# Altium project Flash_DDR.PrjPCB
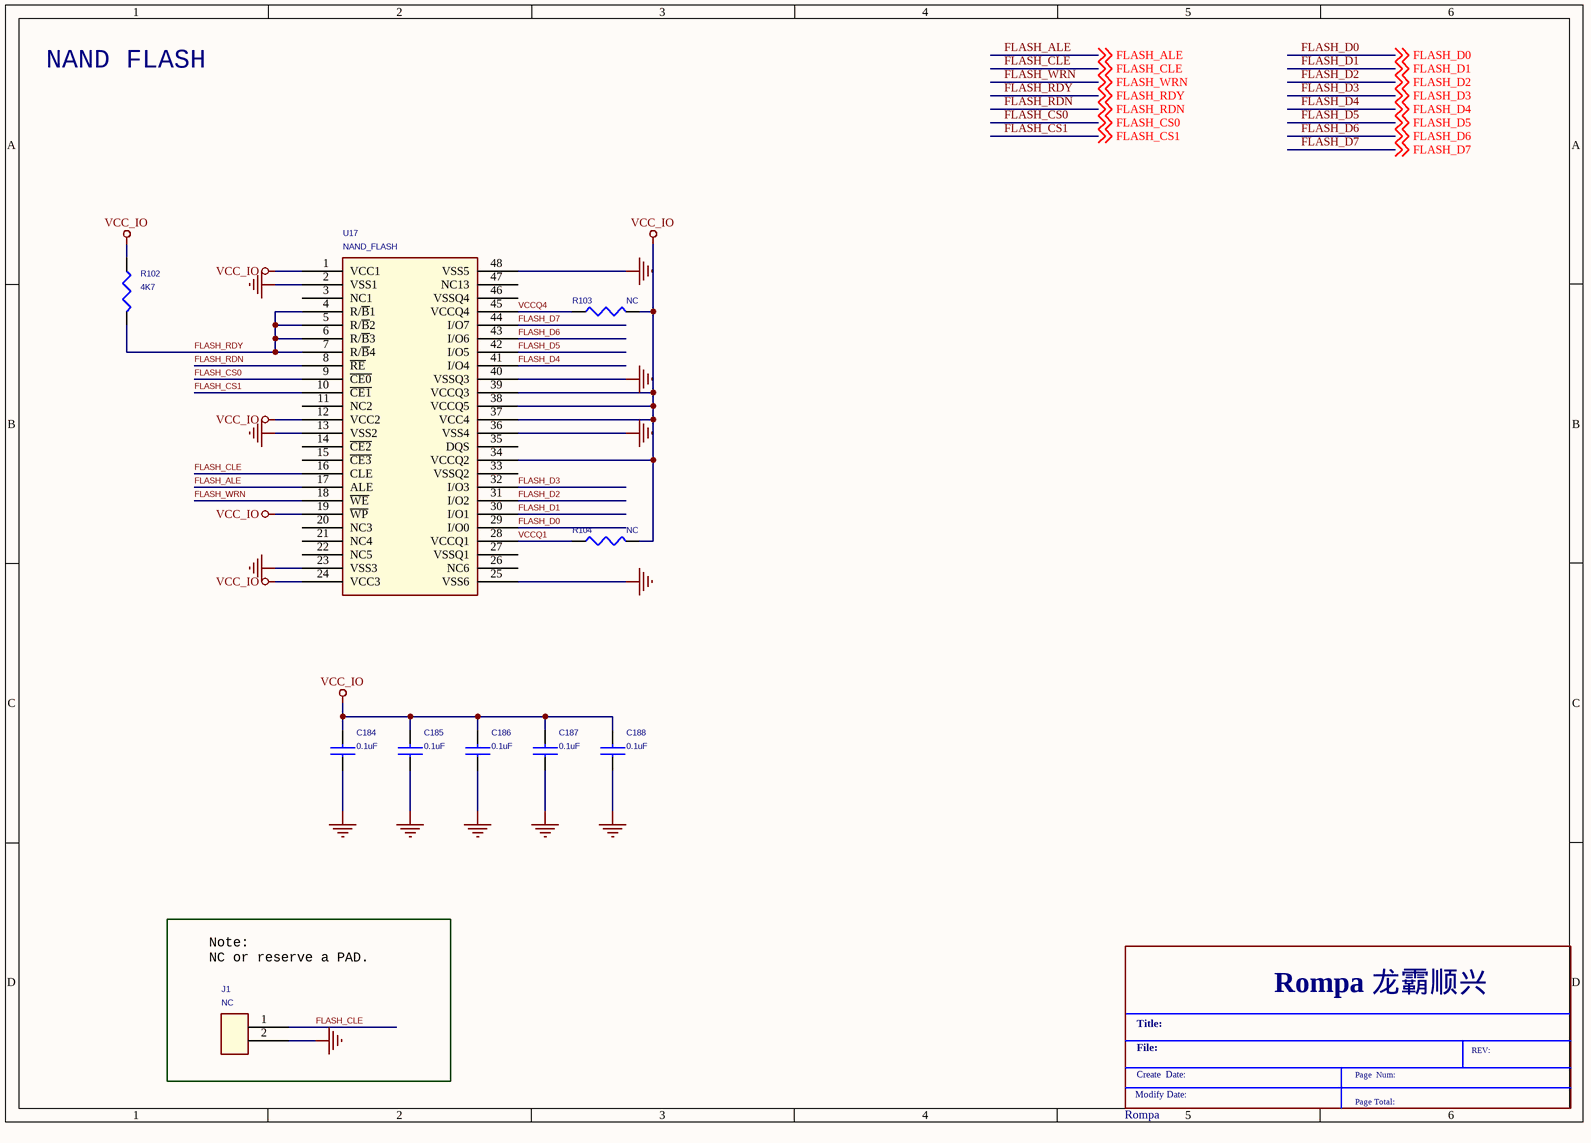
[diagram p0: Option_Nand_Flash.SchDoc]
2 sheets, 50 parts. Net scope: global (net labels, ports and power ports of the same name join across sheets).
Sheets:
  Option_Nand_Flash.SchDoc
  Option_DDR3_96ball.SchDoc

## Sheet Option_Nand_Flash.SchDoc
size 297 x 209 mm

### Parts
*  Rompa  (graphical)
C184  0.1uF  [C0402]
C185  0.1uF  [C0402]
C186  0.1uF  [C0402]
C187  0.1uF  [C0402]
C188  0.1uF  [C0402]
J1  NC  [R0603]
R102  4K7  [R0402]
R103  NC  [R0402]
R104  NC  [R0402]
U17  NAND_FLASH  [TSOP1-48]

### Nets
GND: C184.1 C185.1 C186.1 C187.1 C188.1 J1.2 U17.2(VSS1) U17.13(VSS2) U17.23(VSS3) U17.25(VSS6) U17.36(VSS4) U17.40(VSSQ3) U17.48(VSS5)
VCC_IO: C184.2 C185.2 C186.2 C187.2 C188.2 R102.1 R103.2 R104.2 U17.1(VCC1) U17.12(VCC2) U17.19(~{WP}) U17.24(VCC3) U17.34(VCCQ2) U17.37(VCC4) U17.38(VCCQ5) U17.39(VCCQ3)
FLASH_ALE: U17.17(ALE) ; off-sheet FLASH_ALE
FLASH_CLE: J1.1 U17.16(CLE) ; off-sheet FLASH_CLE
FLASH_CS0: U17.9(~{CE0}) ; off-sheet FLASH_CS0
FLASH_CS1: U17.10(~{CE1}) ; off-sheet FLASH_CS1
FLASH_D0: U17.29(I/O0) ; off-sheet FLASH_D0
FLASH_D1: U17.30(I/O1) ; off-sheet FLASH_D1
FLASH_D2: U17.31(I/O2) ; off-sheet FLASH_D2
FLASH_D3: U17.32(I/O3) ; off-sheet FLASH_D3
FLASH_D4: U17.41(I/O4) ; off-sheet FLASH_D4
FLASH_D5: U17.42(I/O5) ; off-sheet FLASH_D5
FLASH_D6: U17.43(I/O6) ; off-sheet FLASH_D6
FLASH_D7: U17.44(I/O7) ; off-sheet FLASH_D7
FLASH_RDN: U17.8(~{RE}) ; off-sheet FLASH_RDN
FLASH_RDY: R102.2 U17.4(R/~{B}1) U17.5(R/~{B}2) U17.6(R/~{B}3) U17.7(R/~{B}4) ; off-sheet FLASH_RDY
FLASH_WRN: U17.18(~{WE}) ; off-sheet FLASH_WRN
VCCQ1: R104.1 U17.28(VCCQ1)
VCCQ4: R103.1 U17.45(VCCQ4)

Not connected (* = marked no-connect by the designer): U17 3(NC1) 11(NC2) 14(~{CE2}) 15(~{CE3}) 20(NC3) 21(NC4) 22(NC5) 26(NC6) 27(VSSQ1) 33(VSSQ2) 35(DQS) 46(VSSQ4) 47(NC13)

### Notes on the sheet
- NAND FLASH
- (near J1) Note:
  NC or reserve a PAD.
- (in symbol Rompa) Rompa 龙霸顺兴; Title:; File:; REV:; Create  Date:; Page  Num:; Modify Date:; Page Total:

### Library data of the parts
C184-C188 = CAP NP: RoHS CHIP CAP 0.1uF +10/-10% X7R
J1 = CON2: TEST
R102-R104 = RES 1B: ROHS CHIP RES 4.7K 1/16W 5%
U17 = NANDFLASH_0: NAND Flash,2.7V,3.3V,3.6V,2G*8,N/A,-40℃~85℃,TSOP-48P

## Sheet Option_DDR3_96ball.SchDoc
size 297 x 209 mm
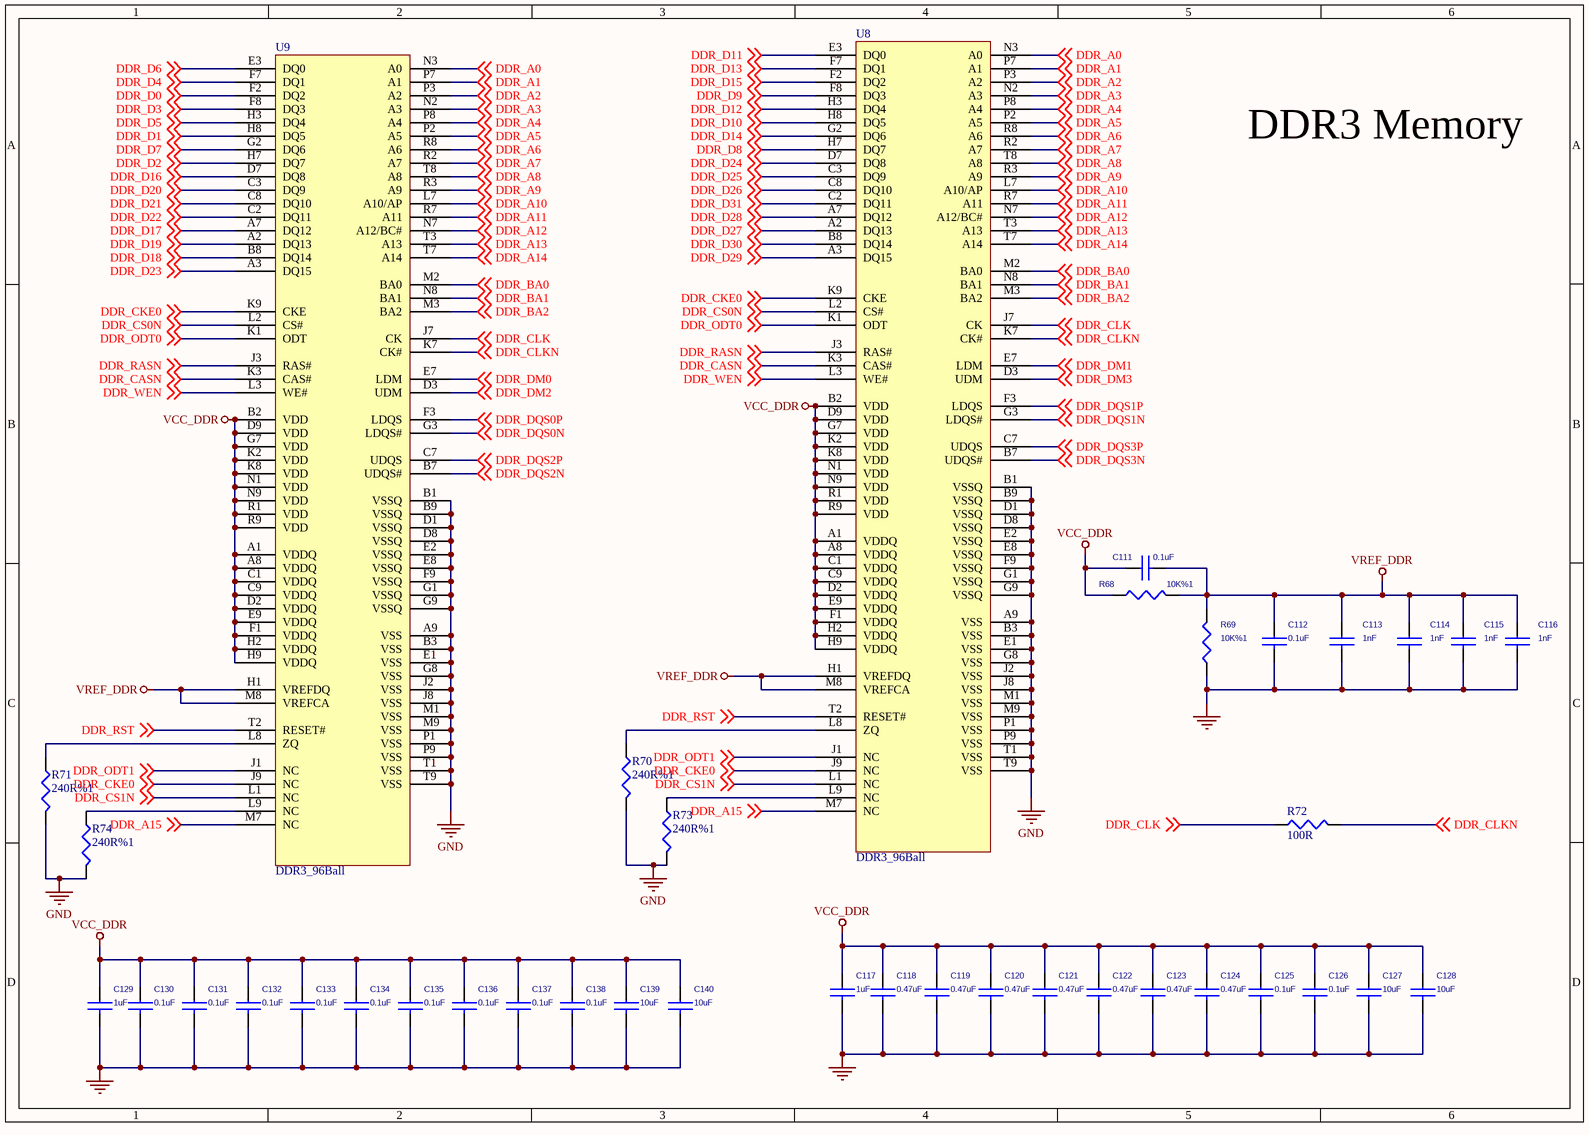
[diagram p1: Option_DDR3_96ball.SchDoc]

### Parts
C111  0.1uF  [C0402]
C112  0.1uF  [C0402]
C113  1nF  [C0402]
C114  1nF  [C0402]
C115  1nF  [C0402]
C116  1nF  [C0402]
C117  1uF  [C0402]
C118  0.47uF  [C0402]
C119  0.47uF  [C0402]
C120  0.47uF  [C0402]
C121  0.47uF  [C0402]
C122  0.47uF  [C0402]
C123  0.47uF  [C0402]
C124  0.47uF  [C0402]
C125  0.1uF  [C0402]
C126  0.1uF  [C0402]
C127  10uF  [C0805]
C128  10uF  [C0805]
C129  1uF  [C0402]
C130  0.1uF  [C0402]
C131  0.1uF  [C0402]
C132  0.1uF  [C0402]
C133  0.1uF  [C0402]
C134  0.1uF  [C0402]
C135  0.1uF  [C0402]
C136  0.1uF  [C0402]
C137  0.1uF  [C0402]
C138  0.1uF  [C0402]
C139  10uF  [C0805]
C140  10uF  [C0805]
R68  10K%1  [R0402]
R69  10K%1  [R0402]
R70  240R%1  [R0402]
R71  240R%1  [R0402]
R72  100R  [R0402]
R73  240R%1  [R0402]
R74  240R%1  [R0402]
U8  DDR3_96Ball
U9  DDR3_96Ball

### Nets
GND: C112.2 C113.2 C114.2 C115.2 C116.2 C117.2 C118.2 C119.2 C120.2 C121.2 C122.2 C123.2 C124.2 C125.2 C126.2 C127.2 C128.2 C129.2 C130.2 C131.2 C132.2 C133.2 C134.2 C135.2 C136.2 C137.2 C138.2 C139.2 C140.2 R69.1 R70.2 R71.2 R73.2 R74.2 U8.A9(VSS) U8.B1(VSSQ) U8.B3(VSS) U8.B9(VSSQ) U8.D1(VSSQ) U8.D8(VSSQ) U8.E1(VSS) U8.E2(VSSQ) U8.E8(VSSQ) U8.F9(VSSQ) U8.G1(VSSQ) U8.G8(VSS) U8.G9(VSSQ) U8.J2(VSS) U8.J8(VSS) U8.M1(VSS) U8.M9(VSS) U8.P1(VSS) U8.P9(VSS) U8.T1(VSS) U8.T9(VSS) U9.A9(VSS) U9.B1(VSSQ) U9.B3(VSS) U9.B9(VSSQ) U9.D1(VSSQ) U9.D8(VSSQ) U9.E1(VSS) U9.E2(VSSQ) U9.E8(VSSQ) U9.F9(VSSQ) U9.G1(VSSQ) U9.G8(VSS) U9.G9(VSSQ) U9.J2(VSS) U9.J8(VSS) U9.M1(VSS) U9.M9(VSS) U9.P1(VSS) U9.P9(VSS) U9.T1(VSS) U9.T9(VSS)
VCC_DDR: C111.1 C117.1 C118.1 C119.1 C120.1 C121.1 C122.1 C123.1 C124.1 C125.1 C126.1 C127.1 C128.1 C129.1 C130.1 C131.1 C132.1 C133.1 C134.1 C135.1 C136.1 C137.1 C138.1 C139.1 C140.1 R68.1 U8.A1(VDDQ) U8.A8(VDDQ) U8.B2(VDD) U8.C1(VDDQ) U8.C9(VDDQ) U8.D2(VDDQ) U8.D9(VDD) U8.E9(VDDQ) U8.F1(VDDQ) U8.G7(VDD) U8.H2(VDDQ) U8.H9(VDDQ) U8.K2(VDD) U8.K8(VDD) U8.N1(VDD) U8.N9(VDD) U8.R1(VDD) U8.R9(VDD) U9.A1(VDDQ) U9.A8(VDDQ) U9.B2(VDD) U9.C1(VDDQ) U9.C9(VDDQ) U9.D2(VDDQ) U9.D9(VDD) U9.E9(VDDQ) U9.F1(VDDQ) U9.G7(VDD) U9.H2(VDDQ) U9.H9(VDDQ) U9.K2(VDD) U9.K8(VDD) U9.N1(VDD) U9.N9(VDD) U9.R1(VDD) U9.R9(VDD)
VREF_DDR: C111.2 C112.1 C113.1 C114.1 C115.1 C116.1 R68.2 R69.2 U8.H1(VREFDQ) U8.M8(VREFCA) U9.H1(VREFDQ) U9.M8(VREFCA)
DDR_A0: U8.N3(A0) U9.N3(A0) ; off-sheet DDR_A0
DDR_A1: U8.P7(A1) U9.P7(A1) ; off-sheet DDR_A1
DDR_A2: U8.P3(A2) U9.P3(A2) ; off-sheet DDR_A2
DDR_A3: U8.N2(A3) U9.N2(A3) ; off-sheet DDR_A3
DDR_A4: U8.P8(A4) U9.P8(A4) ; off-sheet DDR_A4
DDR_A5: U8.P2(A5) U9.P2(A5) ; off-sheet DDR_A5
DDR_A6: U8.R8(A6) U9.R8(A6) ; off-sheet DDR_A6
DDR_A7: U8.R2(A7) U9.R2(A7) ; off-sheet DDR_A7
DDR_A8: U8.T8(A8) U9.T8(A8) ; off-sheet DDR_A8
DDR_A9: U8.R3(A9) U9.R3(A9) ; off-sheet DDR_A9
DDR_A10: U8.L7(A10/AP) U9.L7(A10/AP) ; off-sheet DDR_A10
DDR_A11: U8.R7(A11) U9.R7(A11) ; off-sheet DDR_A11
DDR_A12: U8.N7(A12/BC#) U9.N7(A12/BC#) ; off-sheet DDR_A12
DDR_A13: U8.T3(A13) U9.T3(A13) ; off-sheet DDR_A13
DDR_A14: U8.T7(A14) U9.T7(A14) ; off-sheet DDR_A14
DDR_A15: U8.M7(NC) U9.M7(NC) ; off-sheet DDR_A15
DDR_BA0: U8.M2(BA0) U9.M2(BA0) ; off-sheet DDR_BA0
DDR_BA1: U8.N8(BA1) U9.N8(BA1) ; off-sheet DDR_BA1
DDR_BA2: U8.M3(BA2) U9.M3(BA2) ; off-sheet DDR_BA2
DDR_CASN: U8.K3(CAS#) U9.K3(CAS#) ; off-sheet DDR_CASN
DDR_CKE0: U8.J9(NC) U8.K9(CKE) U9.J9(NC) U9.K9(CKE) ; off-sheet DDR_CKE0
DDR_CLK: R72.1 U8.J7(CK) U9.J7(CK) ; off-sheet DDR_CLK
DDR_CLKN: R72.2 U8.K7(CK#) U9.K7(CK#) ; off-sheet DDR_CLKN
DDR_CS0N: U8.L2(CS#) U9.L2(CS#) ; off-sheet DDR_CS0N
DDR_CS1N: U8.L1(NC) U9.L1(NC) ; off-sheet DDR_CS1N
DDR_D0: U9.F2(DQ2) ; off-sheet DDR_D0
DDR_D1: U9.H8(DQ5) ; off-sheet DDR_D1
DDR_D2: U9.H7(DQ7) ; off-sheet DDR_D2
DDR_D3: U9.F8(DQ3) ; off-sheet DDR_D3
DDR_D4: U9.F7(DQ1) ; off-sheet DDR_D4
DDR_D5: U9.H3(DQ4) ; off-sheet DDR_D5
DDR_D6: U9.E3(DQ0) ; off-sheet DDR_D6
DDR_D7: U9.G2(DQ6) ; off-sheet DDR_D7
DDR_D8: U8.H7(DQ7) ; off-sheet DDR_D8
DDR_D9: U8.F8(DQ3) ; off-sheet DDR_D9
DDR_D10: U8.H8(DQ5) ; off-sheet DDR_D10
DDR_D11: U8.E3(DQ0) ; off-sheet DDR_D11
DDR_D12: U8.H3(DQ4) ; off-sheet DDR_D12
DDR_D13: U8.F7(DQ1) ; off-sheet DDR_D13
DDR_D14: U8.G2(DQ6) ; off-sheet DDR_D14
DDR_D15: U8.F2(DQ2) ; off-sheet DDR_D15
DDR_D16: U9.D7(DQ8) ; off-sheet DDR_D16
DDR_D17: U9.A7(DQ12) ; off-sheet DDR_D17
DDR_D18: U9.B8(DQ14) ; off-sheet DDR_D18
DDR_D19: U9.A2(DQ13) ; off-sheet DDR_D19
DDR_D20: U9.C3(DQ9) ; off-sheet DDR_D20
DDR_D21: U9.C8(DQ10) ; off-sheet DDR_D21
DDR_D22: U9.C2(DQ11) ; off-sheet DDR_D22
DDR_D23: U9.A3(DQ15) ; off-sheet DDR_D23
DDR_D24: U8.D7(DQ8) ; off-sheet DDR_D24
DDR_D25: U8.C3(DQ9) ; off-sheet DDR_D25
DDR_D26: U8.C8(DQ10) ; off-sheet DDR_D26
DDR_D27: U8.A2(DQ13) ; off-sheet DDR_D27
DDR_D28: U8.A7(DQ12) ; off-sheet DDR_D28
DDR_D29: U8.A3(DQ15) ; off-sheet DDR_D29
DDR_D30: U8.B8(DQ14) ; off-sheet DDR_D30
DDR_D31: U8.C2(DQ11) ; off-sheet DDR_D31
DDR_DM0: U9.E7(LDM) ; off-sheet DDR_DM0
DDR_DM1: U8.E7(LDM) ; off-sheet DDR_DM1
DDR_DM2: U9.D3(UDM) ; off-sheet DDR_DM2
DDR_DM3: U8.D3(UDM) ; off-sheet DDR_DM3
DDR_DQS0N: U9.G3(LDQS#) ; off-sheet DDR_DQS0N
DDR_DQS0P: U9.F3(LDQS) ; off-sheet DDR_DQS0P
DDR_DQS1N: U8.G3(LDQS#) ; off-sheet DDR_DQS1N
DDR_DQS1P: U8.F3(LDQS) ; off-sheet DDR_DQS1P
DDR_DQS2N: U9.B7(UDQS#) ; off-sheet DDR_DQS2N
DDR_DQS2P: U9.C7(UDQS) ; off-sheet DDR_DQS2P
DDR_DQS3N: U8.B7(UDQS#) ; off-sheet DDR_DQS3N
DDR_DQS3P: U8.C7(UDQS) ; off-sheet DDR_DQS3P
DDR_ODT0: U8.K1(ODT) U9.K1(ODT) ; off-sheet DDR_ODT0
DDR_ODT1: U8.J1(NC) U9.J1(NC) ; off-sheet DDR_ODT1
DDR_RASN: U8.J3(RAS#) U9.J3(RAS#) ; off-sheet DDR_RASN
DDR_RST: U8.T2(RESET#) U9.T2(RESET#) ; off-sheet DDR_RST
DDR_WEN: U8.L3(WE#) U9.L3(WE#) ; off-sheet DDR_WEN
NetR70_1: R70.1 U8.L8(ZQ)
NetR71_1: R71.1 U9.L8(ZQ)
NetR73_1: R73.1 U8.L9(NC)
NetR74_1: R74.1 U9.L9(NC)

### Notes on the sheet
- DDR3 Memory

### Library data of the parts
C111-C116 = CAP NP_0
C117-C124 C129 C130 = CAP NP: RoHS CHIP CAP 1uF +10/-10% X5R
C125-C128 C131-C140 = CAP NP: RoHS CHIP CAP 0.1uF +10/-10% X7R
R68 R69 = RESISTOR_0: 贴片电阻
R70-R74 = RESISTOR

## Nets that join several sheets
GND: Option_Nand_Flash (13 pins), Option_DDR3_96ball (76 pins)